# Altium project Cradle Controller.PrjPcb
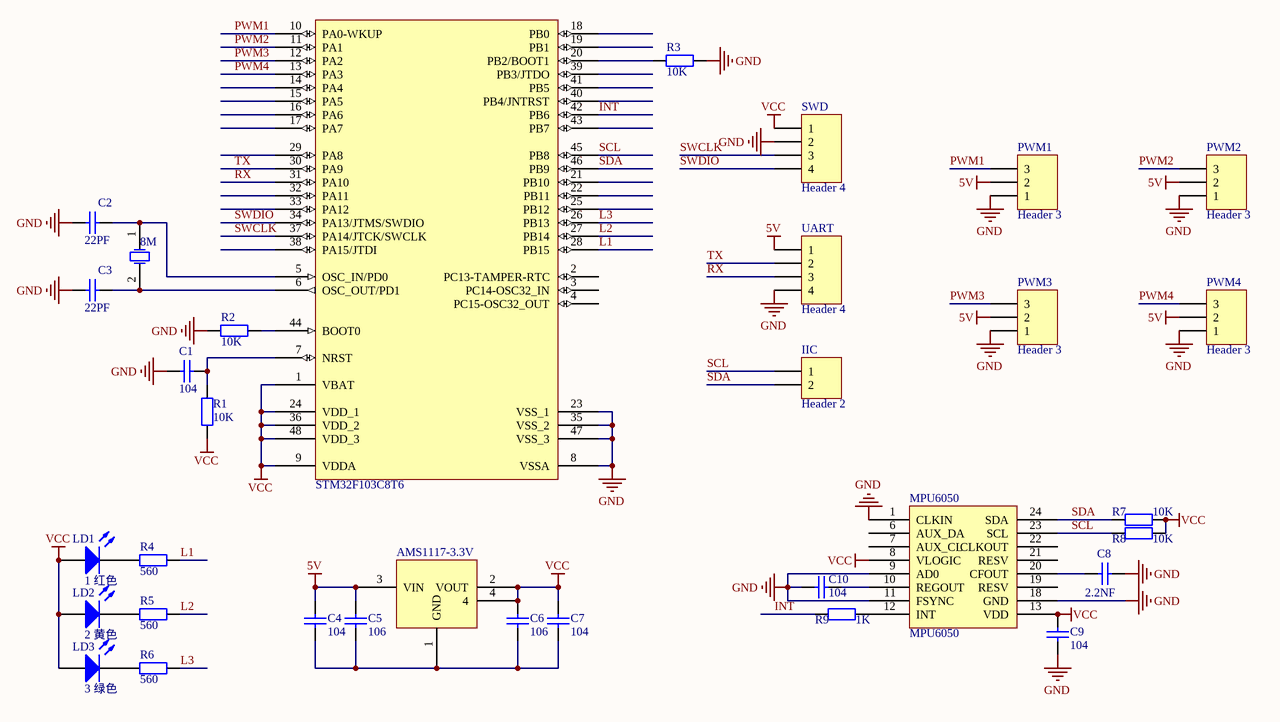
[diagram p0: Cradle Controller.SchDoc]
1 sheet, 33 parts. Net scope: global (net labels, ports and power ports of the same name join across sheets).
Board file: Cradle Controller.PcbDoc

## Sheet Cradle Controller.SchDoc
size A4

### Parts
8M  8M  [SOP10]
AMS1117-3.3V  AMS1117-3.3V  [SOT223_M]  (value not drawn)
C1  104  [C0805]
C2  22PF  [C0805]
C3  value 22PF  [C0805]  (hidden comment: 20PF)
C4  104  [C0805]
C5  106  [C0805]
C6  106  [C0805]
C7  104  [C0805]
C8  2.2NF  [C0805]
C9  104  [C0805]
C10  104  [C0805]
IIC  Header 2  [HDR1X2]
LD1  1 红色  [3.5X2.8X1.9]
LD2  2 黄色  [3.5X2.8X1.9]
LD3  3 绿色  [3.5X2.8X1.9]
MPU6050  MPU6050  [MPU6050]
PWM1  Header 3  [HDR1X3]
PWM2  Header 3  [HDR1X3]
PWM3  Header 3  [HDR1X3]
PWM4  Header 3  [HDR1X3]
R1  10K  [6-0805_M]
R2  10K  [6-0805_M]
R3  10K  [6-0805_M]
R4  560  [6-0805_M]
R5  560  [6-0805_M]
R6  560  [6-0805_M]
R7  10K  [6-0805_M]
R8  10K  [6-0805_M]
R9  1K  [6-0805_M]
STM32F103C8T6  STM32F103C8T6  [LQFP48_N]
SWD  Header 4  [HDR1X4]
UART  Header 4  [HDR1X4]

### Nets
5V: AMS1117-3.3V.3(VIN) C4.1 C5.1 PWM1.2 PWM2.2 PWM3.2 PWM4.2 UART.1
GND: C1.1 C2.1 C3.1 C8.2 C9.1 C10.1 MPU6050.1(CLKIN) MPU6050.9(AD0) MPU6050.11(FSYNC) MPU6050.18(GND) PWM1.1 PWM2.1 PWM3.1 PWM4.1 R2.1 R3.2 STM32F103C8T6.8(VSSA) STM32F103C8T6.23(VSS_1) STM32F103C8T6.35(VSS_2) STM32F103C8T6.47(VSS_3) SWD.2 UART.4
VCC: AMS1117-3.3V.2(VOUT) AMS1117-3.3V.4 C6.1 C7.1 C9.2 LD1.1(A) LD2.1(A) LD3.1(A) MPU6050.8(VLOGIC) MPU6050.13(VDD) R1.1 R7.2 R8.2 STM32F103C8T6.1(VBAT) STM32F103C8T6.9(VDDA) STM32F103C8T6.24(VDD_1) STM32F103C8T6.36(VDD_2) STM32F103C8T6.48(VDD_3) SWD.1
INT: R9.1 STM32F103C8T6.42(PB6)
L1: R4.1 STM32F103C8T6.28(PB15)
L2: R5.1 STM32F103C8T6.27(PB14)
L3: R6.1 STM32F103C8T6.26(PB13)
PWM1: PWM1.3 STM32F103C8T6.10(PA0-WKUP)
PWM2: PWM2.3 STM32F103C8T6.11(PA1)
PWM3: PWM3.3 STM32F103C8T6.12(PA2)
PWM4: PWM4.3 STM32F103C8T6.13(PA3)
RX: STM32F103C8T6.31(PA10) UART.3
SCL: IIC.1 MPU6050.23(SCL) R8.1 STM32F103C8T6.45(PB8)
SDA: IIC.2 MPU6050.24(SDA) R7.1 STM32F103C8T6.46(PB9)
SWCLK: STM32F103C8T6.37(PA14/JTCK/SWCLK) SWD.3
SWDIO: STM32F103C8T6.34(PA13/JTMS/SWDIO) SWD.4
TX: STM32F103C8T6.30(PA9) UART.2
Net8M_1: 8M.1(OSC1) C2.2 STM32F103C8T6.5(OSC_IN/PD0)
Net8M_2: 8M.2(OSC2) C3.2 STM32F103C8T6.6(OSC_OUT/PD1)
NetAMS1117-3.3V_1: AMS1117-3.3V.1(GND) C4.2 C5.2 C6.2 C7.2
NetC1_2: C1.2 R1.2 STM32F103C8T6.7(NRST)
NetC8_1: C8.1 MPU6050.20(CFOUT)
NetC10_2: C10.2 MPU6050.10(REGOUT)
NetLD1_2: LD1.2(K) R4.2
NetLD2_2: LD2.2(K) R5.2
NetLD3_2: LD3.2(K) R6.2
NetMPU6050_12: MPU6050.12(INT) R9.2
NetR2_2: R2.2 STM32F103C8T6.44(BOOT0)
NetR3_1: R3.1 STM32F103C8T6.20(PB2/BOOT1)

Not connected (* = marked no-connect by the designer): MPU6050 6(AUX_DA) 7(AUX_CL) 19(RESV) 21(RESV) 22(CLKOUT); STM32F103C8T6 2(PC13-TAMPER-RTC) 3(PC14-OSC32_IN) 4(PC15-OSC32_OUT) 14(PA4) 15(PA5) 16(PA6) 17(PA7) 18(PB0) 19(PB1) 21(PB10) 22(PB11) 25(PB12) 29(PA8) 32(PA11) 33(PA12) 38(PA15/JTDI) 39(PB3/JTDO) 40(PB4/JNTRST) 41(PB5) 43(PB7)

### Library data of the parts
8M = XTAL: Crystal Oscillator; Published: 8-Jun-2000; LatestRevisionDate: 17-Jul-2002; LatestRevisionNote: Re-released for DXP Platform.; PackageReference: R38; Publisher: Altium Limited; PackageDescription: Crystal, Thru-Hole; 2 Leads; Body 3.1 x 8.2 mm (Dia.xH)
AMS1117-3.3V = 1117-3.3V
C1-C3 C8-C10 = Cap: Capacitor; Published: 8-Jun-2000; LatestRevisionDate: 17-Jul-2002; LatestRevisionNote: Re-released for DXP Platform.; PackageReference: RAD-0.3; Publisher: Altium Limited; PackageDescription: Radial Cap, Thru-Hole; 2 Leads; 0.3 in Pin Spacing
  C1 C9 C10: Value: 104
  C2: Value: 22PF
  C8: Value: 2.2NF
C4-C7 = Cap Semi: Capacitor (Semiconductor SIM Model); Published: 8-Jun-2000; LatestRevisionDate: 29-May-2009; LatestRevisionNote: IPC-7351 Footprint Added.; PackageReference: C1206; Publisher: Altium Limited; PackageDescription: Chip Capacitor
  C4 C7: Value: 104
  C5 C6: Value: 106
IIC = Header 2: Header, 2-Pin; LatestRevisionDate: 17-Jul-2002; LatestRevisionNote: Re-released for DXP Platform.; Publisher: Altium Limited
LD1-LD3 = LED3: Typical BLUE SiC LED; Published: 8-Jun-2000; LatestRevisionDate: 17-Dec-2003; LatestRevisionNote: PCB Footprint replaced.; DatasheetVersion: 16-Apr-2002; PackageVersion: 16-Apr-2002; PackageReference: 3.5X2.8X1.9; Publisher: Altium Limited; PackageDescription: SM LED; 2 C-Bend Leads; Body 3.5 x 2.8 x 1.9 mm, inc leads (LxWxH typ)
PWM1-PWM4 = Header 3: Header, 3-Pin; LatestRevisionDate: 17-Jul-2002; LatestRevisionNote: Re-released for DXP Platform.; Publisher: Altium Limited
R1-R3 R7-R9 = Res2: Resistor; Value: 0; Published: 8-Jun-2000; LatestRevisionDate: 17-Jul-2002; LatestRevisionNote: Re-released for DXP Platform.; PackageReference: AXIAL-0.4; Publisher: Altium Limited; PackageDescription: Axial Device, Thru-Hole; 2 Leads; 0.4 in Pin Spacing
R4-R6 = Res2: Resistor; Published: 8-Jun-2000; LatestRevisionDate: 17-Jul-2002; LatestRevisionNote: Re-released for DXP Platform.; PackageReference: AXIAL-0.4; Publisher: Altium Limited; PackageDescription: Axial Device, Thru-Hole; 2 Leads; 0.4 in Pin Spacing; Value: 560
STM32F103C8T6 = STM32F103C8T6: STM32 ARM-based 32-bit MCU with 64 Kbytes Flash, 48-pin LQFP, Industrial Temperature; Published: 30-May-2008; DatasheetVersion: rev6, Mar-2008; PackageVersion: Mar-2008; PackageReference: LQFP48; Publisher: Altium Limited; PackageDescription: 48-Pin Low-Profile Quad Flat Pack, 7 x 7 mm Body, 0.5 mm Pitch (LQFP48); ComponentLink1Description: Manufacturer Link; ComponentLink1URL: www.st.com/stm32; ComponentLink2Description: Datasheet; ComponentLink2URL: http://www.st.com/stonline/products/literature/ds/13587.pdf
SWD UART = Header 4: Header, 4-Pin; LatestRevisionDate: 17-Jul-2002; LatestRevisionNote: Re-released for DXP Platform.; Publisher: Altium Limited